# Altium schematic sheet [04] - 2560TK_Schematic_2.SchDoc
size A4
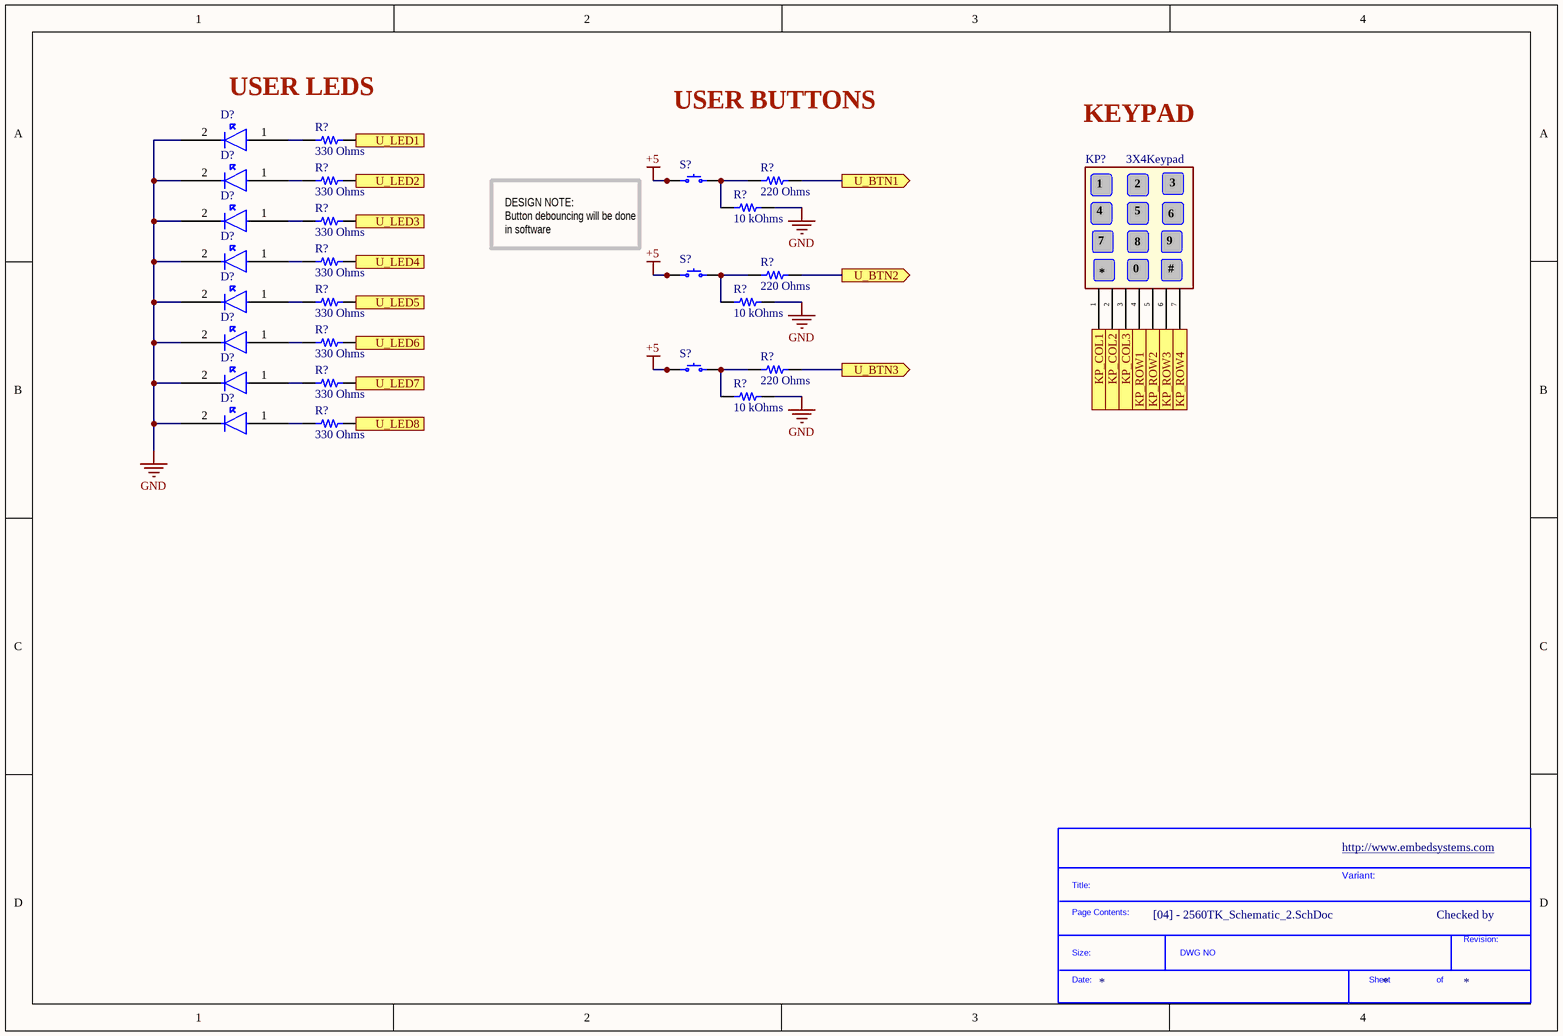
[diagram p0: [04] - 2560TK_Schematic_2.SchDoc]

## Parts
(Parts that share a designator on the sheet are numbered #1, #2 ... from top to bottom, then left to right.)
*?  SDTitleBlock  (value not drawn)  (graphical)
D?#1  LED_5mm  [LED_5mm]  (value not drawn)
D?#2  LED_5mm  [LED_5mm]  (value not drawn)
D?#3  LED_5mm  [LED_5mm]  (value not drawn)
D?#4  LED_5mm  [LED_5mm]  (value not drawn)
D?#5  LED_5mm  [LED_5mm]  (value not drawn)
D?#6  LED_5mm  [LED_5mm]  (value not drawn)
D?#7  LED_5mm  [LED_5mm]  (value not drawn)
D?#8  LED_5mm  [LED_5mm]  (value not drawn)
KP?  3X4Keypad  [COM-08653]
R?#1  330 Ohms  [RES 0805_2012]
R?#2  330 Ohms  [RES 0805_2012]
R?#3  220 Ohms  [RES 0805_2012]
R?#4  10 kOhms  [RES 0805_2012]
R?#5  330 Ohms  [RES 0805_2012]
R?#6  330 Ohms  [RES 0805_2012]
R?#7  220 Ohms  [RES 0805_2012]
R?#8  330 Ohms  [RES 0805_2012]
R?#9  10 kOhms  [RES 0805_2012]
R?#10  330 Ohms  [RES 0805_2012]
R?#11  220 Ohms  [RES 0805_2012]
R?#12  330 Ohms  [RES 0805_2012]
R?#13  10 kOhms  [RES 0805_2012]
R?#14  330 Ohms  [RES 0805_2012]
S?#1  PTS645SM43SMTR92 LFS  [C&K PTS645]  (value not drawn)
S?#2  PTS645SM43SMTR92 LFS  [C&K PTS645]  (value not drawn)
S?#3  PTS645SM43SMTR92 LFS  [C&K PTS645]  (value not drawn)

## Ports
KP_COL1 (in), KP_COL2 (in), KP_COL3 (in), KP_ROW1 (out), KP_ROW2 (out), KP_ROW3 (out), KP_ROW4 (out), U_BTN1 (out), U_BTN2 (out), U_BTN3 (out), U_LED1 (in), U_LED2 (in), U_LED3 (in), U_LED4 (in), U_LED5 (in), U_LED6 (in), U_LED7 (in), U_LED8 (in)

## Nets
+5: S?#1.1 S?#1.2 S?#2.1 S?#2.2 S?#3.1 S?#3.2
GND: D?#1.2 D?#2.2 D?#3.2 D?#4.2 D?#5.2 D?#6.2 D?#7.2 D?#8.2 R?#4.2 R?#9.2 R?#13.2
KP_COL1: KP?.1 ; port KP_COL1
KP_COL2: KP?.2 ; port KP_COL2
KP_COL3: KP?.3 ; port KP_COL3
KP_ROW1: KP?.4 ; port KP_ROW1
KP_ROW2: KP?.5 ; port KP_ROW2
KP_ROW3: KP?.6 ; port KP_ROW3
KP_ROW4: KP?.7 ; port KP_ROW4
U_BTN1: R?#3.2 ; port U_BTN1
U_BTN2: R?#7.2 ; port U_BTN2
U_BTN3: R?#11.2 ; port U_BTN3
U_LED1: R?#1.2 ; port U_LED1
U_LED2: R?#2.2 ; port U_LED2
U_LED3: R?#5.2 ; port U_LED3
U_LED4: R?#6.2 ; port U_LED4
U_LED5: R?#8.2 ; port U_LED5
U_LED6: R?#10.2 ; port U_LED6
U_LED7: R?#12.2 ; port U_LED7
U_LED8: R?#14.2 ; port U_LED8
NetD?#1_1: D?#1.1 R?#1.1
NetD?#2_1: D?#2.1 R?#2.1
NetD?#3_1: D?#3.1 R?#5.1
NetD?#4_1: D?#4.1 R?#6.1
NetD?#5_1: D?#5.1 R?#8.1
NetD?#6_1: D?#6.1 R?#10.1
NetD?#7_1: D?#7.1 R?#12.1
NetD?#8_1: D?#8.1 R?#14.1
NetR?#3_1: R?#3.1 R?#4.1 S?#1.3 S?#1.4
NetR?#7_1: R?#7.1 R?#9.1 S?#2.3 S?#2.4
NetR?#11_1: R?#11.1 R?#13.1 S?#3.3 S?#3.4

## Notes on the sheet
- USER LEDS
- USER BUTTONS
- KEYPAD
- (near S?#1) DESIGN NOTE:
  Button debouncing will be done in software
- http://www.embedsystems.com
- Variant:
- Checked by
- (in symbol 3X4Keypad) 8; 9; 0; #
- (in symbol SDTitleBlock) Title:; Page Contents:; Revision:; Size:; DWG NO; Date:; Sheet; of

## Library data of the parts
D?#1-D?#8 = LED_5mm: 5MM LED; Manufacturer: Kingbright; Manufacturer Part Number: WP7113ND; Stock 1: 50; Pricing 1: 1=0.67000, 10=0.41100, 100=0.23650, 1000=0.18508, 2000=0.16966, 5000=0.15423, 10000=0.14395, 25000=0.13881 (USD); Supplier 1: Digi-Key; Supplier Part Number 1: 754-1896-ND; ComponentLink1Description: Datasheet; ComponentLink1URL: https://www.kingbrightusa.com/images/catalog/SPEC/WP7113ND.pdf
KP? = 3X4Keypad: 3x4 Matrix Keypad; Manufacturer: Adafruit Industries; Manufacturer Part Number: 3845; Stock 1: 43; Pricing 1: 1=6.50000 (USD); Supplier 1: Digi-Key; Supplier Part Number 1: 1528-2673-ND
R?#1 R?#2 R?#5 R?#6 R?#8 R?#10 R?#12 R?#14 = RC0805FR-07330RL: RES SMD 330 OHM 1% 1/8W 0805; Manufacturer: Yageo; Power (Watts): 0.125W, 1/8W; Temperature Coefficient: ±100ppm/°C; Part Number: RC0805FR-07330RL; Value: 330 Ohms; ComponentLink1Description: Datasheet; ComponentLink1URL: https://www.yageo.com/upload/media/product/productsearch/datasheet/rchip/PYu-RC_Group_51_RoHS_L_10.pdf; ComponentLink2Description: DigiKey Link; ComponentLink2URL: http://digikey.com/product-detail/en/yageo/RC0805FR-07330RL/311-330CRCT-ND/730813; Composition: Thick Film; Device Package: 0805 (2012 Metric); Features: Moisture Resistant; Height - Seated (Max): 0.024" (0.60mm); LastUpdated: 02/09/2020 01:15:14; Lifecycle Status: Active; Minimum Order: 1; Number of Terminations: 2; Operating Temperature: -55°C ~ 155°C; Package / Case: 0805 (2012 Metric); Packaging: CutTape; PartId: 32600; Part Status: Active; Price: 0.10; Resistance: 330 Ohms; Series: RC; Size / Dimension: 0.079" L x 0.049" W (2.00mm x 1.25mm); Supplier 1: DigiKey; Supplier Part Number 1: 311-330CRCT-ND; Supplier Device Package: 0805; Tolerance: ±1%
R?#3 R?#7 R?#11 = ERJ-6ENF2200V: RES SMD 220 OHM 1% 1/8W 0805; Manufacturer: Panasonic Electronic Components; Power (Watts): 0.125W, 1/8W; Temperature Coefficient: ±100ppm/°C; Part Number: ERJ-6ENF2200V; Value: 220 Ohms; ComponentLink1Description: Datasheet; ComponentLink1URL: https://industrial.panasonic.com/cdbs/www-data/pdf/RDA0000/AOA0000C304.pdf; ComponentLink2Description: DigiKey Link; ComponentLink2URL: http://digikey.com/product-detail/en/panasonic-electronic-components/ERJ-6ENF2200V/P220CCT-ND/1746831; Composition: Thick Film; Device Package: 0805 (2012 Metric); Features: Automotive AEC-Q200; Height - Seated (Max): 0.028" (0.70mm); LastUpdated: 02/09/2020 01:15:19; Lifecycle Status: Active; Minimum Order: 1; Number of Terminations: 2; Operating Temperature: -55°C ~ 155°C; Package / Case: 0805 (2012 Metric); Packaging: TapeAndReel; PartId: 30101; Part Status: Active; Price: 0.01; Ratings: AEC-Q200; Resistance: 220 Ohms; Series: ERJ; Size / Dimension: 0.079" L x 0.049" W (2.00mm x 1.25mm); Supplier 1: DigiKey; Supplier Part Number 1: P220CCT-ND; Supplier Device Package: 0805; Tolerance: ±1%
R?#4 R?#9 R?#13 = CPF0805B10KE: RES SMD 10K OHM 0.1% 1/10W 0805; Manufacturer: TE Connectivity Passive Product; Power (Watts): 0.1W, 1/10W; Temperature Coefficient: ±25ppm/°C; Part Number: CPF0805B10KE; Value: 10 kOhms; ComponentLink1Description: Datasheet; ComponentLink1URL: https://www.te.com/commerce/DocumentDelivery/DDEController?Action=srchrtrv&DocNm=1773200&DocType=DS&DocLang=English; ComponentLink2Description: DigiKey Link; ComponentLink2URL: http://digikey.com/product-detail/en/te-connectivity-passive-product/CPF0805B10KE/A106043CT-ND/3477679; Composition: Thin Film; Device Package: 0805 (2012 Metric); Height - Seated (Max): 0.026" (0.65mm); LastUpdated: 02/09/2020 01:15:24; Lifecycle Status: Active; Minimum Order: 1; Number of Terminations: 2; Operating Temperature: -55°C ~ 155°C; Package / Case: 0805 (2012 Metric); Packaging: TapeAndReel; PartId: 27724; Part Status: Active; Price: 0.09; Resistance: 10 kOhms; Series: CPF, Neohm; Size / Dimension: 0.079" L x 0.049" W (2.00mm x 1.25mm); Supplier 1: DigiKey; Supplier Part Number 1: A106043CT-ND; Supplier Device Package: 0805; Tolerance: ±0.1%
S?#1-S?#3 = PTS645SM43SMTR92 LFS: SWITCH TACTILE SPST-NO 0.05A 12V; Manufacturer: C&K; Actuator Height off PCB, Vertical: 4.30mm; Actuator Orientation: Top Actuated; Actuator Type: Standard; Contact Rating @ Voltage: 0.05A @ 12VDC; Illumination: Non-Illuminated; Operating Force: 160gf; Outline: 6.00mm x 6.00mm; Switch Function: Off-Mom; Part Number: PTS645SM43SMTR92 LFS; Circuit: SPST-NO; ComponentLink1Description: Datasheet; ComponentLink1URL: https://dznh3ojzb2azq.cloudfront.net/products/Tactile/PTS645/documents/datasheet.pdf; ComponentLink2Description: DigiKey Link; ComponentLink2URL: http://digikey.com/product-detail/en/c-k/PTS645SM43SMTR92-LFS/CKN9112CT-ND/1146934; Features: Blue Actuator; LastUpdated: 09/04/2020 09:59:00; Lifecycle Status: Active; Minimum Order: 1; Mounting Type: Surface Mount; Operating Temperature: -20°C ~ 60°C; Packaging: TapeAndReel; Part Status: Active; Price: 0.09; Series: PTS645; Supplier 1: DigiKey; Supplier Part Number 1: CKN9112CT-ND; Termination Style: Gull Wing